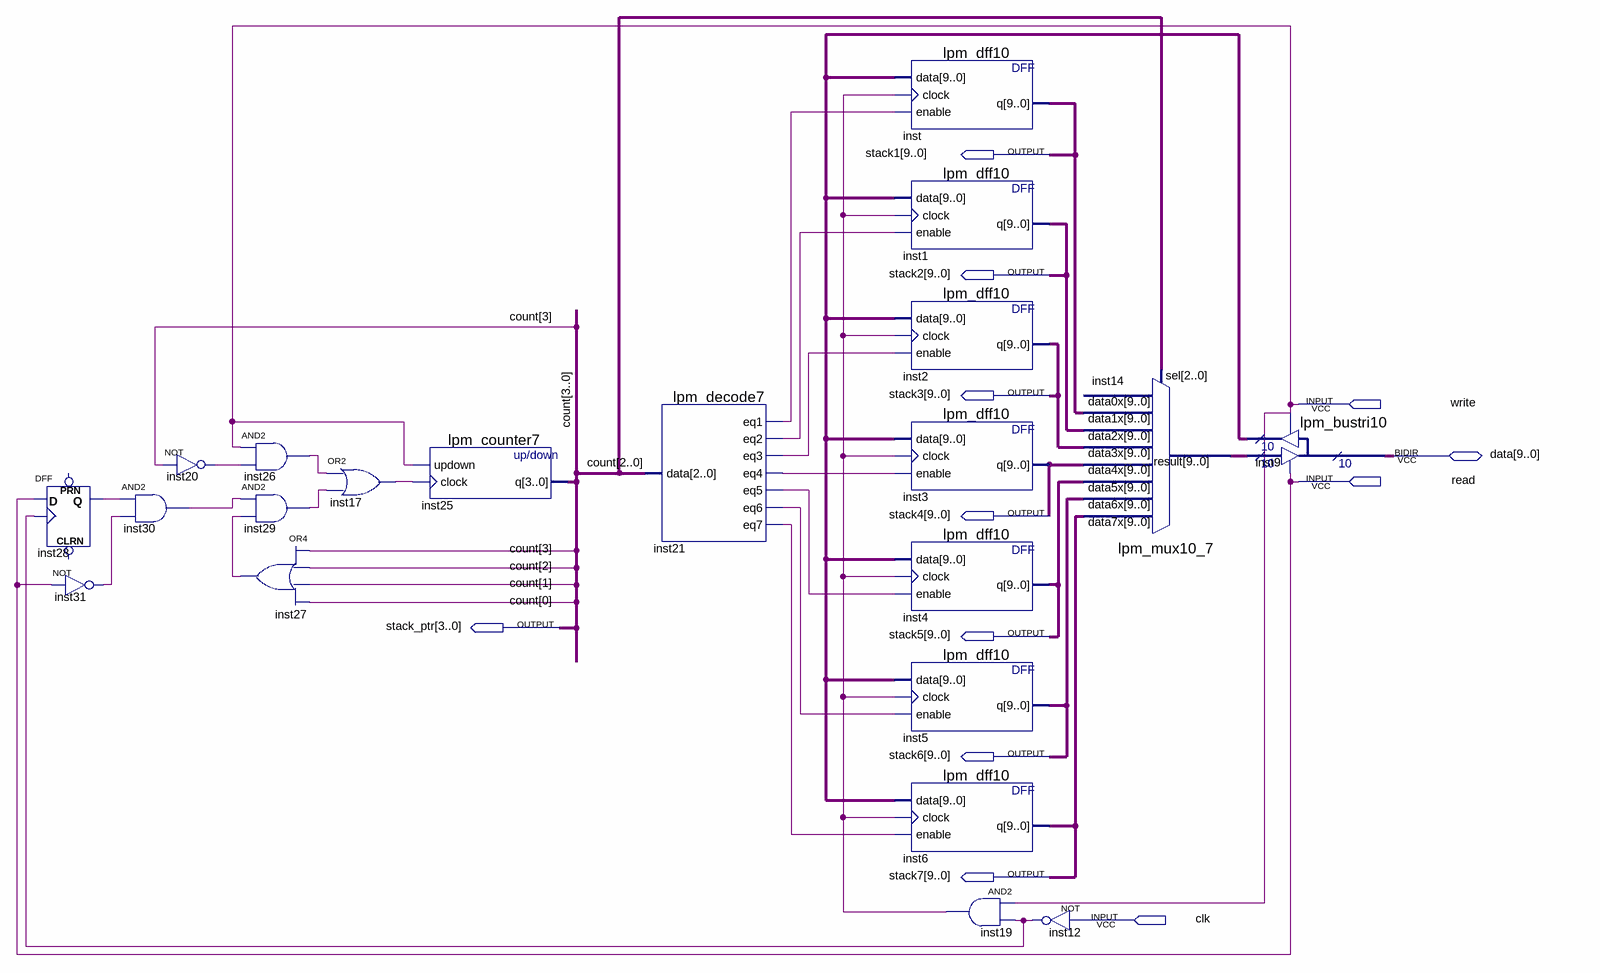
[diagram p0: schematic sheet]
// Quartus schematic stack.bdf as structural Verilog: 21 symbols, 12 pins
module stack (
  input  write,
  input  read,
  input  clk,
  inout  [9:0] data,
  output [9:0] stack1,
  output [9:0] stack2,
  output [9:0] stack3,
  output [9:0] stack4,
  output [3:0] stack_ptr,
  output [9:0] stack5,
  output [9:0] stack6,
  output [9:0] stack7
);

  wire inst12_out, inst17_out, inst19_out, inst20_out, inst21_eq1, inst21_eq2, inst21_eq3, inst21_eq4,
       inst21_eq5, inst21_eq6, inst21_eq7, inst26_out, inst27_out, inst28_q, inst29_out, inst30_out,
       inst31_out;
  wire [9:0] inst9_result, inst14_result;

  DFF inst28 (.CLK(inst12_out), .D(read), .Q(inst28_q));  // open: CLRN, PRN
  not inst31 (inst31_out, read);
  and inst30 (inst30_out, inst28_q, inst31_out);
  not inst20 (inst20_out, stack_ptr[3]);
  and inst26 (inst26_out, write, inst20_out);
  and inst29 (inst29_out, inst30_out, inst27_out);
  or inst27 (inst27_out, stack_ptr[3], stack_ptr[2], stack_ptr[1], stack_ptr[0]);
  or inst17 (inst17_out, inst26_out, inst29_out);
  lpm_counter7 inst25 (.updown(write), .clock(inst17_out), .q(stack_ptr));
  lpm_decode7 inst21 (
    .data(stack_ptr[2:0]), .eq1(inst21_eq1), .eq2(inst21_eq2), .eq3(inst21_eq3), .eq4(inst21_eq4),
    .eq5(inst21_eq5), .eq6(inst21_eq6), .eq7(inst21_eq7));
  lpm_dff10 inst (.data(inst9_result), .clock(inst19_out), .enable(inst21_eq1), .q(stack1));
  lpm_dff10 inst1 (.data(inst9_result), .clock(inst19_out), .enable(inst21_eq2), .q(stack2));
  lpm_dff10 inst2 (.data(inst9_result), .clock(inst19_out), .enable(inst21_eq3), .q(stack3));
  lpm_dff10 inst3 (.data(inst9_result), .clock(inst19_out), .enable(inst21_eq4), .q(stack4));
  lpm_dff10 inst4 (.data(inst9_result), .clock(inst19_out), .enable(inst21_eq5), .q(stack5));
  lpm_dff10 inst5 (.data(inst9_result), .clock(inst19_out), .enable(inst21_eq6), .q(stack6));
  lpm_dff10 inst6 (.data(inst9_result), .clock(inst19_out), .enable(inst21_eq7), .q(stack7));
  and inst19 (inst19_out, write, inst12_out);
  lpm_mux10_7 inst14 (
    .data7x(stack7), .data6x(stack6), .data5x(stack5), .data4x(stack4), .data3x(stack3), .data2x(stack2),
    .data1x(stack1), .sel(stack_ptr[2:0]), .result(inst14_result));  // open: data0x
  not inst12 (inst12_out, clk);
  lpm_bustri10 inst9 (.enabledt(read), .data(inst14_result), .enabletr(write), .result(inst9_result), .tridata(data));

  // Other names for the same wires on the sheet: count[3:0] = stack_ptr
endmodule
